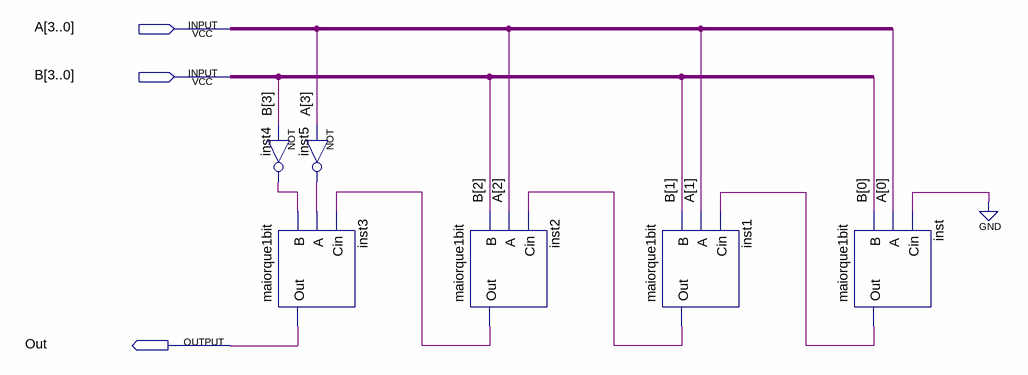
[diagram p0: schematic sheet]
// Quartus schematic maiorque4bits.bdf as structural Verilog: 6 symbols, 3 pins
module maiorque4bits (
  input  [3:0] A,
  input  [3:0] B,
  output Out
);

  wire inst1_out, inst2_out, inst4_out, inst5_out, inst_out;

  not inst5 (inst5_out, A[3]);
  not inst4 (inst4_out, B[3]);
  maiorque1bit inst3 (.B(inst4_out), .A(inst5_out), .Cin(inst2_out), .Out(Out));
  maiorque1bit inst2 (.B(B[2]), .A(A[2]), .Cin(inst1_out), .Out(inst2_out));
  maiorque1bit inst1 (.B(B[1]), .A(A[1]), .Cin(inst_out), .Out(inst1_out));
  maiorque1bit inst (.B(B[0]), .A(A[0]), .Cin(1'b0), .Out(inst_out));
endmodule
